# Altium schematic sheet Sheet5.SchDoc
size A3; DocumentNumber: 5; SheetNumber: 5; SheetTotal: 6
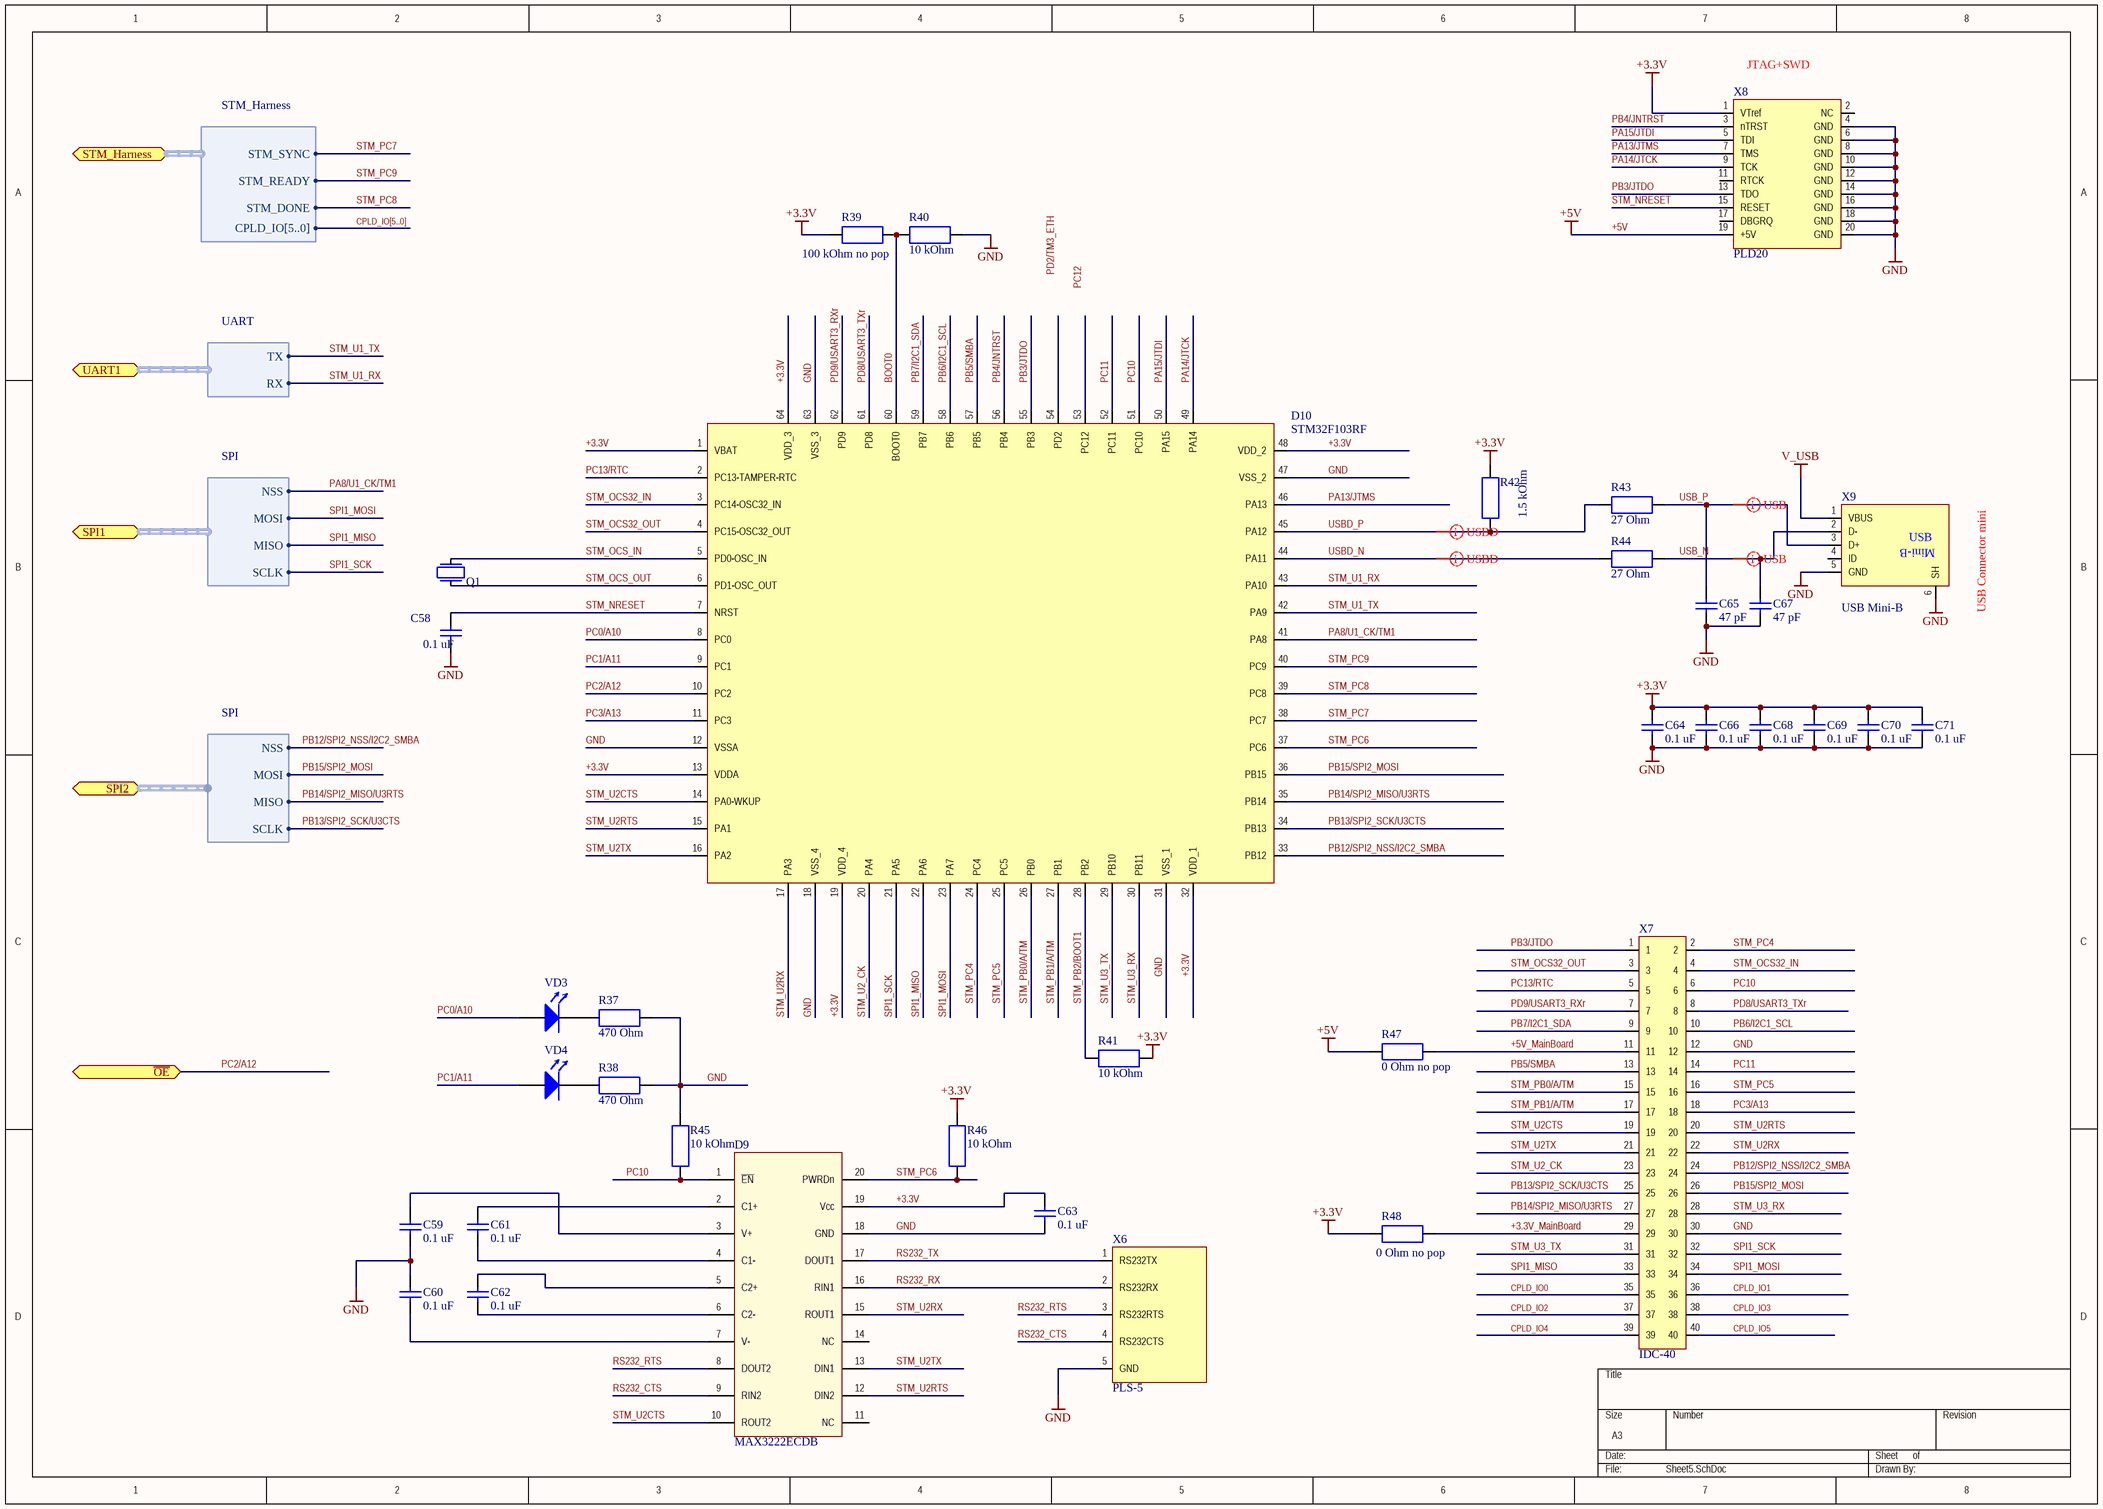
[diagram p0: Sheet5.SchDoc]

## Parts
C58  0.1 uF  [CAPC1608N]
C59  0.1 uF  [CAPC1608N]
C60  0.1 uF  [CAPC1608N]
C61  0.1 uF  [CAPC1608N]
C62  0.1 uF  [CAPC1608N]
C63  0.1 uF  [CAPC1608N]
C64  0.1 uF  [CAPC1608N]
C65  47 pF  [CAPC1608N]
C66  0.1 uF  [CAPC1608N]
C67  47 pF  [CAPC1608N]
C68  0.1 uF  [CAPC1608N]
C69  0.1 uF  [CAPC1608N]
C70  0.1 uF  [CAPC1608N]
C71  0.1 uF  [CAPC1608N]
D9  MAX3222ECDB  [SOP65P780X200-20N]
D10  STM32F103RF  [LQFP64]
Q1  Quarz  [HC-49/U3H]  (value not drawn)
R37  470 Ohm  [RESC1608N]
R38  470 Ohm  [RESC1608N]
R39  100 kOhm no pop  [RESC1608N]
R40  10 kOhm  [RESC1608N]
R41  10 kOhm  [RESC1608N]
R42  1.5 kOhm  [RESC1608N]
R43  27 Ohm  [RESC1608N]
R44  27 Ohm  [RESC1608N]
R45  10 kOhm  [RESC1608N]
R46  10 kOhm  [RESC1608N]
R47  0 Ohm no pop  [RESC1608N]
R48  0 Ohm no pop  [RESC1608N]
VD3  KP-1608SURC  [LED1608N]  (value not drawn)
VD4  KP-1608SURC  [LED1608N]  (value not drawn)
X6  PLS-5  [PLS-5]
X7  IDC-40  [PLD-40]
X8  PLD20  [PLD-20]
X9  USB Mini-B  [USBMINIB]

## Ports
SPI1 (harness SPI), SPI2 (harness SPI), STM_Harness (harness STM_Harness), UART1 (harness UART), ~{OE}

## Harnesses
STM_Harness: STM_DONE, STM_READY, STM_SYNC, CPLD_IO[5..0]
SPI: NSS, MOSI, MISO, SCLK
UART: TX, RX

## Nets
+3.3V: C63.2 C64.2 C66.2 C68.2 C69.2 C70.2 C71.2 D9.19(Vcc) D10.1(VBAT) D10.13(VDDA) D10.19(VDD_4) D10.32(VDD_1) D10.48(VDD_2) D10.64(VDD_3) R39.2 R41.1 R42.2 R46.2 R48.2 X8.1(VTref)
+5V: R47.2 X8.19(+5V)
GND: C58.1 C59.1 C60.2 C63.1 C64.1 C65.1 C66.1 C67.1 C68.1 C69.1 C70.1 C71.1 D9.18(GND) D10.12(VSSA) D10.18(VSS_4) D10.31(VSS_1) D10.47(VSS_2) D10.63(VSS_3) R37.2 R38.2 R40.1 R45.2 X6.5(GND) X7.12 X7.30 X8.4(GND) X8.6(GND) X8.8(GND) X8.10(GND) X8.12(GND) X8.14(GND) X8.16(GND) X8.18(GND) X8.20(GND) X9.5(GND) X9.6(SH)
V_USB: X9.1(VBUS)
+3.3V_MainBoard: R48.1 X7.29
+5V_MainBoard: R47.1 X7.11
BOOT0: D10.60(BOOT0) R39.1 R40.2
CPLD_IO0: X7.35
CPLD_IO1: X7.36
CPLD_IO2: X7.37
CPLD_IO3: X7.38
CPLD_IO4: X7.39
CPLD_IO5: X7.40
PA8/U1_CK/TM1: D10.41(PA8) ; port SPI1.NSS
PA13/JTMS: D10.46(PA13) X8.7(TMS)
PA14/JTCK: D10.49(PA14) X8.9(TCK)
PA15/JTDI: D10.50(PA15) X8.5(TDI)
PB3/JTDO: D10.55(PB3) X7.1 X8.13(TDO)
PB4/JNTRST: D10.56(PB4) X8.3(nTRST)
PB5/SMBA: D10.57(PB5) X7.13
PB6/I2C1_SCL: D10.58(PB6) X7.10
PB7/I2C1_SDA: D10.59(PB7) X7.9
PB12/SPI2_NSS/I2C2_SMBA: D10.33(PB12) X7.24 ; port SPI2.NSS
PB13/SPI2_SCK/U3CTS: D10.34(PB13) X7.25 ; port SPI2.SCLK
PB14/SPI2_MISO/U3RTS: D10.35(PB14) X7.27 ; port SPI2.MISO
PB15/SPI2_MOSI: D10.36(PB15) X7.26 ; port SPI2.MOSI
PC0/A10: D10.8(PC0) VD3.1(A)
PC1/A11: D10.9(PC1) VD4.1(A)
PC2/A12: D10.10(PC2) ; port ~{OE}
PC3/A13: D10.11(PC3) X7.18
PC10: D9.1(~{EN}) D10.51(PC10) R45.1 X7.6
PC11: D10.52(PC11) X7.14
PC13/RTC: D10.2(PC13-TAMPER-RTC) X7.5
PD8/USART3_TXr: D10.61(PD8) X7.8
PD9/USART3_RXr: D10.62(PD9) X7.7
RS232_CTS: D9.9(RIN2) X6.4(RS232CTS)
RS232_RTS: D9.8(DOUT2) X6.3(RS232RTS)
RS232_RX: D9.16(RIN1) X6.2(RS232RX)
RS232_TX: D9.17(DOUT1) X6.1(RS232TX)
SPI1_MISO: D10.22(PA6) X7.33 ; port SPI1.MISO
SPI1_MOSI: D10.23(PA7) X7.34 ; port SPI1.MOSI
SPI1_SCK: D10.21(PA5) X7.32 ; port SPI1.SCLK
STM_NRESET: C58.2 D10.7(NRST) X8.15(RESET)
STM_OCS32_IN: D10.3(PC14-OSC32_IN) X7.4
STM_OCS32_OUT: D10.4(PC15-OSC32_OUT) X7.3
STM_OCS_IN: D10.5(PD0-OSC_IN) Q1.2
STM_OCS_OUT: D10.6(PD1-OSC_OUT) Q1.1
STM_PB0/A/TM: D10.26(PB0) X7.15
STM_PB1/A/TM: D10.27(PB1) X7.17
STM_PB2/BOOT1: D10.28(PB2) R41.2
STM_PC4: D10.24(PC4) X7.2
STM_PC5: D10.25(PC5) X7.16
STM_PC6: D9.20(PWRDn) D10.37(PC6) R46.1
STM_PC7: D10.38(PC7) ; port STM_Harness.STM_SYNC
STM_PC8: D10.39(PC8) ; port STM_Harness.STM_DONE
STM_PC9: D10.40(PC9) ; port STM_Harness.STM_READY
STM_U1_RX: D10.43(PA10) ; port UART1.RX
STM_U1_TX: D10.42(PA9) ; port UART1.TX
STM_U2_CK: D10.20(PA4) X7.23
STM_U2CTS: D9.10(ROUT2) D10.14(PA0-WKUP) X7.19
STM_U2RTS: D9.12(DIN2) D10.15(PA1) X7.20
STM_U2RX: D9.15(ROUT1) D10.17(PA3) X7.22
STM_U2TX: D9.13(DIN1) D10.16(PA2) X7.21
STM_U3_RX: D10.30(PB11) X7.28
STM_U3_TX: D10.29(PB10) X7.31
USB_N: C67.2 R44.1 X9.2(D-)
USB_P: C65.2 R43.1 X9.3(D+)
USBD_N: D10.44(PA11) R44.2
USBD_P: D10.45(PA12) R42.1 R43.2
NetC59_2: C59.2 D9.3(V+)
NetC60_1: C60.1 D9.7(V-)
NetC61_1: C61.1 D9.4(C1-)
NetC61_2: C61.2 D9.2(C1+)
NetC62_1: C62.1 D9.6(C2-)
NetC62_2: C62.2 D9.5(C2+)
NetR37_1: R37.1 VD3.2(K)
NetR38_1: R38.1 VD4.2(K)

Not connected (* = marked no-connect by the designer): D9 11(NC) 14(NC); D10 53(PC12) 54(PD2); X8 2(NC) 11(RTCK) 17(DBGRQ); X9 4(ID)

## Buses and harness runs
bus CPLD_IO[5..0]

## Layout directives
differential pair: USB_N, USB_P, USBD_N, USBD_P

## Notes on the sheet
- (near X8) JTAG+SWD
- (near X9) USB Connector mini
- Labels drawn without touching a wire or pin: PC12, PD2/TM3_ETH
- (in symbol USB-MINI-B) USB; Mini-B

## Library data of the parts
C58-C71 = CC0603: ±10%, X7R, 0603; MaxVoltage: 10Vdc; Value: 1µF; Published: 2014; LatestRevisionDate: 2014; LatestRevisionNote: Re-released for DXP Platform.; PackageReference: RAD-0.3; Publisher: DS; PackageDescription: ChipCapasitor; HelpURL: http://product.tdk.com/capacitor/mlcc/en/documents/mlcc_commercial_general_en.pdf; Supplier 1: Digi-Key; Supplier Part Number 1: 445-4998-1-ND
D9 = MAX3222ECDB: RS232 driver
D10 = STM32F103RF: STM32F103RF LQFP64
Q1 = Quarz: Ceramic quarz; MaxVoltage: 10Vdc; Value: 1µF; Published: 2014; LatestRevisionDate: 2014; LatestRevisionNote: Re-released for DXP Platform.; PackageReference: RAD-0.3; Publisher: DS; PackageDescription: ChipCapasitor; HelpURL: http://product.tdk.com/capacitor/mlcc/en/documents/mlcc_commercial_general_en.pdf
R37-R48 = RES0603: ±5%, 0603; MaxVoltage: 10Vdc; Value: 1µF; Published: 2014; LatestRevisionDate: 2014; LatestRevisionNote: Re-released for DXP Platform.; PackageReference: RAD-0.3; Publisher: DS; PackageDescription: ChipCapasitor; HelpURL: http://product.tdk.com/capacitor/mlcc/en/documents/mlcc_commercial_general_en.pdf
X6 = RS232
X7 = IDC40: PLD-40 or IDC 40
X8 = JTAG
X9 = USB-MINI-B
VD3 VD4 = KP-1608SURC: Published: 29-Sep-2000; LatestRevisionDate: 17-Jul-2002; LatestRevisionNote: Re-released for DXP Platform.; PackageReference: 299-02; Publisher: Altium Limited; PackageDescription: Diode, Axial; Body 5.1 x 2.3 mm (LxDia. max), Lead Dia. 0.56 mm (max); Code_JEDEC: DO-204-AH; ComponentLink1Description: Manufacturer Link; ComponentLink1URL: http://www.onsemi.com/site/products/landing?taxonomyID=194